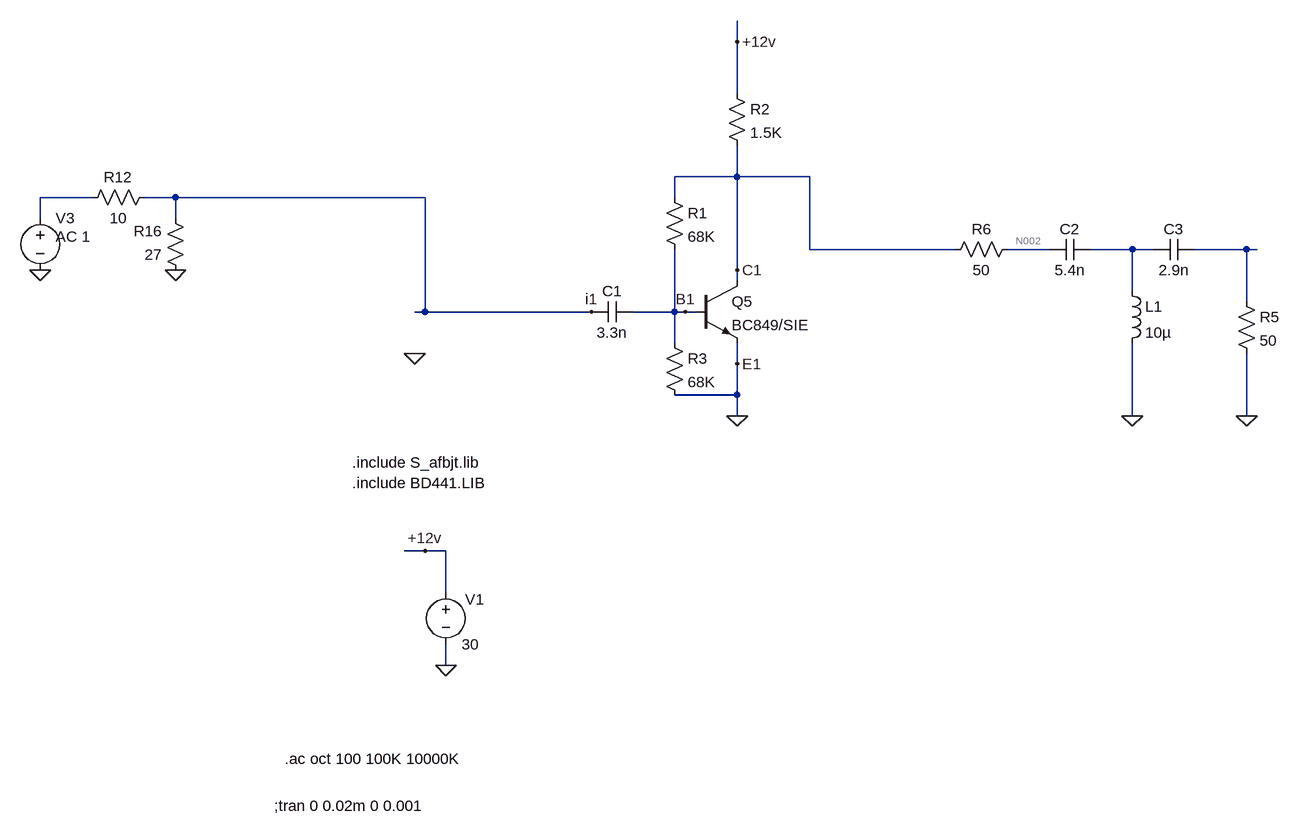
[diagram p0: schematic amplifier_denis_bez_emit_povt.asc]
amplifier_denis_bez_emit_povt.asc, the LTspice schematic file:
Version 4
SHEET 1 2036 900
WIRE 496 -624 496 -656
WIRE 496 -544 496 -624
WIRE 496 -416 496 -464
WIRE 496 -416 400 -416
WIRE 608 -416 496 -416
WIRE -496 -384 -576 -384
WIRE -368 -384 -416 -384
WIRE 16 -384 -368 -384
WIRE 400 -384 400 -416
WIRE -576 -352 -576 -384
WIRE -368 -352 -368 -384
WIRE 608 -304 608 -416
WIRE 832 -304 608 -304
WIRE 976 -304 912 -304
WIRE 1104 -304 1040 -304
WIRE 1136 -304 1104 -304
WIRE 1280 -304 1200 -304
WIRE 1296 -304 1280 -304
WIRE 496 -272 496 -416
WIRE 496 -256 496 -272
WIRE 1104 -240 1104 -304
WIRE 1280 -224 1280 -304
WIRE 16 -208 16 -384
WIRE 16 -208 0 -208
WIRE 272 -208 16 -208
WIRE 400 -208 400 -304
WIRE 400 -208 336 -208
WIRE 416 -208 400 -208
WIRE 432 -208 416 -208
WIRE 400 -160 400 -208
WIRE 496 -128 496 -160
WIRE 496 -80 496 -128
WIRE 496 -80 400 -80
WIRE 496 -48 496 -80
WIRE 1104 -48 1104 -160
WIRE 1280 -48 1280 -144
WIRE 16 160 -16 160
WIRE 48 160 16 160
WIRE 48 224 48 160
WIRE 48 336 48 304
FLAG 48 336 0
FLAG 16 160 +12v
FLAG 496 -624 +12v
FLAG 496 -48 0
FLAG 272 -208 i1
FLAG -576 -272 0
FLAG 416 -208 B1
FLAG 496 -272 C1
FLAG 496 -128 E1
FLAG -368 -272 0
FLAG 0 -144 0
FLAG 1104 -48 0
FLAG 1280 -48 0
SYMBOL voltage 48 208 R0
WINDOW 0 30 27 Left 2
WINDOW 123 0 0 Left 0
WINDOW 39 0 0 Left 0
SYMATTR InstName V1
SYMATTR Value 30
SYMBOL res 480 -560 R0
SYMATTR InstName R2
SYMATTR Value 1.5K
SYMBOL npn 432 -256 R0
SYMATTR InstName Q5
SYMATTR Value BC849/SIE
SYMBOL cap 336 -224 R90
WINDOW 0 0 32 VBottom 2
WINDOW 3 32 32 VTop 2
SYMATTR InstName C1
SYMATTR Value 3.3n
SYMBOL voltage -576 -368 R0
WINDOW 123 24 44 Left 2
WINDOW 39 0 0 Left 0
SYMATTR Value2 AC 1
SYMATTR InstName V3
SYMATTR Value ""
SYMBOL res -400 -400 R90
WINDOW 0 0 56 VBottom 2
WINDOW 3 32 56 VTop 2
SYMATTR InstName R12
SYMATTR Value 10
SYMBOL res -352 -256 R180
WINDOW 0 36 76 Left 2
WINDOW 3 36 40 Left 2
SYMATTR InstName R16
SYMATTR Value 27
SYMBOL res 384 -400 R0
SYMATTR InstName R1
SYMATTR Value 68K
SYMBOL res 384 -176 R0
SYMATTR InstName R3
SYMATTR Value 68K
SYMBOL cap 1040 -320 R90
WINDOW 0 0 32 VBottom 2
WINDOW 3 32 32 VTop 2
SYMATTR InstName C2
SYMATTR Value 5.4n
SYMBOL ind 1088 -256 R0
SYMATTR InstName L1
SYMATTR Value 10µ
SYMBOL cap 1200 -320 R90
WINDOW 0 0 32 VBottom 2
WINDOW 3 32 32 VTop 2
SYMATTR InstName C3
SYMATTR Value 2.9n
SYMBOL res 1264 -240 R0
SYMATTR InstName R5
SYMATTR Value 50
SYMBOL res 928 -320 R90
WINDOW 0 0 56 VBottom 2
WINDOW 3 32 56 VTop 2
SYMATTR InstName R6
SYMATTR Value 50
TEXT -96 24 Left 2 !.include S_afbjt.lib\n.include BD441.LIB
TEXT -216 552 Left 2 !;tran 0 0.02m 0 0.001
TEXT -200 480 Left 2 !.ac oct 100 100K 10000K

The netlist it stands for:
* amplifier_denis_bez_emit_povt.asc
V1 +12v 0 30
R2 +12v C1 1.5K
Q5 C1 B1 0 0 BC849/SIE
C1 B1 i1 3.3n
V3 N001 0 AC 1
R12 i1 N001 10
R16 0 i1 27
R1 C1 B1 68K
R3 B1 0 68K
C2 N003 N002 5.4n
L1 N003 0 10µ
C3 N004 N003 2.9n
R5 N004 0 50
R6 N002 C1 50
.model NPN NPN
.model PNP PNP
.lib standard.bjt
.include S_afbjt.lib
.include BD441.LIB
;tran 0 0.02m 0 0.001
.ac oct 100 100K 10000K
.backanno
.end

* Results of the author's LTspice run, read from the files saved beside the schematic
* Operating Point, zero values left out:
*   V(+12v) = 30 V
*   V(c1) = 3.781 V
*   V(b1) = 704.3 mV
*   V(n002) = 3.781 V
*   Ic(Q5) = 17.43 mA
*   Ib(Q5) = 34.89 µA
*   Ie(Q5) = -17.47 mA
*   I(R3) = 10.36 µA
*   I(R1) = 45.25 µA
*   I(R2) = 17.48 mA
*   I(V1) = -17.48 mA
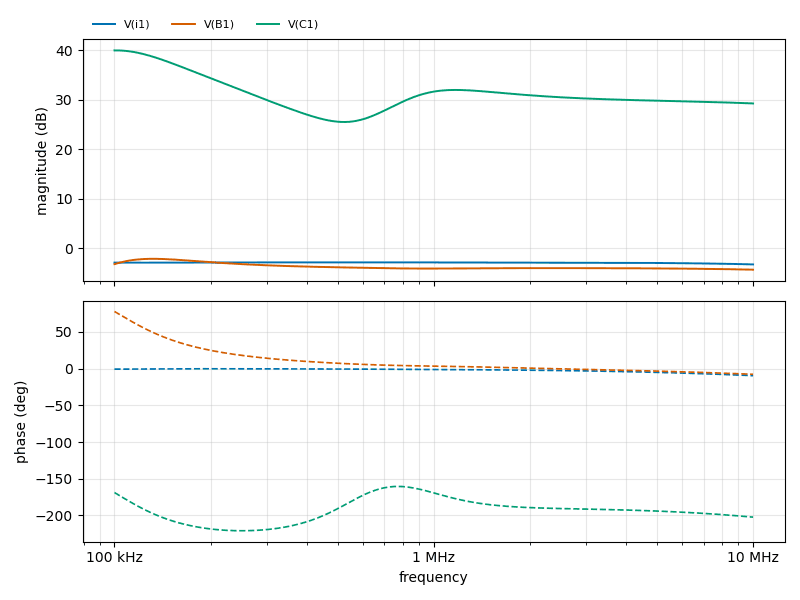
[diagram p1: AC Analysis of amplifier_denis_bez_emit_povt.asc, plotted from the saved traces]
* AC Analysis, 1 run:
*   V(i1): -2.86 dB at 100 kHz, -3.23 dB at 10 MHz, peak -2.81 dB at 632 kHz
*   V(B1): -3.18 dB at 100 kHz, -4.30 dB at 10 MHz, peak -2.10 dB at 132 kHz
*   V(C1): 39.92 dB at 100 kHz, 29.23 dB at 10 MHz, peak 39.92 dB at 101.4 kHz, 3 dB below the peak at 157.5 kHz